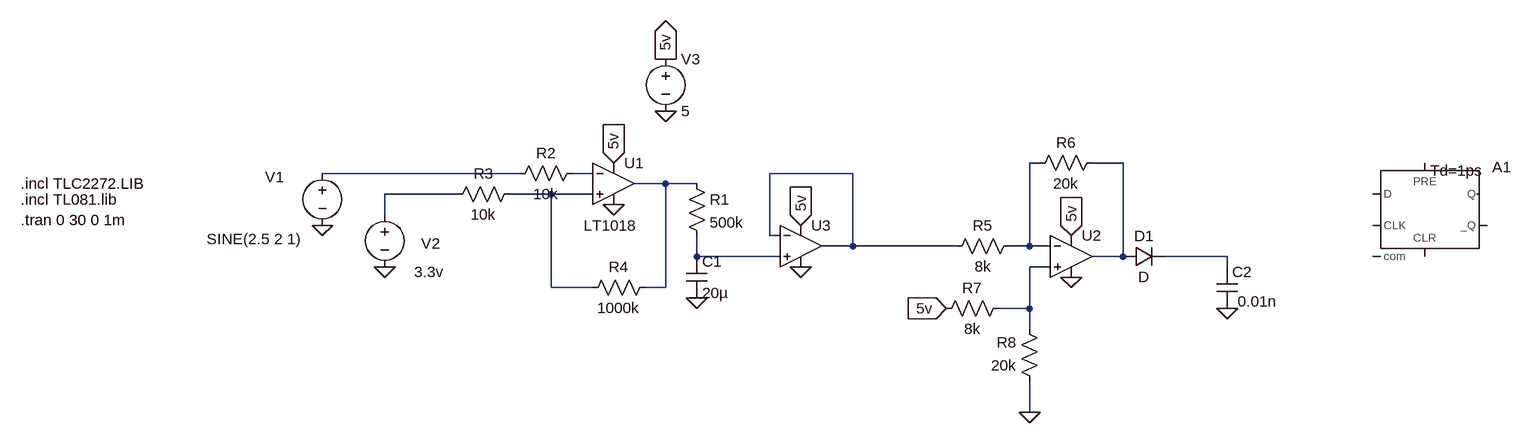
[diagram p0: schematic analogue.asc]
analogue.asc, the LTspice schematic file:
Version 4
SHEET 1 2016 680
WIRE 1184 -48 1168 -48
WIRE 1312 -48 1264 -48
WIRE 384 -32 80 -32
WIRE 496 -32 464 -32
WIRE 896 -32 768 -32
WIRE 608 -16 560 -16
WIRE 656 -16 608 -16
WIRE 288 0 176 0
WIRE 432 0 368 0
WIRE 496 0 432 0
WIRE 176 32 176 0
WIRE 768 64 768 -32
WIRE 784 64 768 64
WIRE 896 80 896 -32
WIRE 896 80 848 80
WIRE 1056 80 896 80
WIRE 1168 80 1168 -48
WIRE 1168 80 1136 80
WIRE 1200 80 1168 80
WIRE 656 96 656 64
WIRE 784 96 656 96
WIRE 1312 96 1312 -48
WIRE 1312 96 1264 96
WIRE 1472 96 1376 96
WIRE 656 112 656 96
WIRE 1200 112 1168 112
WIRE 1472 112 1472 96
WIRE 432 144 432 0
WIRE 496 144 432 144
WIRE 608 144 608 -16
WIRE 608 144 576 144
WIRE 1168 176 1168 112
WIRE 1168 176 1120 176
WIRE 1168 208 1168 176
WIRE 1168 336 1168 288
FLAG 80 48 0
FLAG 1472 176 0
FLAG 656 160 0
FLAG 528 16 0
FLAG 528 -48 5v
IOPIN 528 -48 In
FLAG 176 112 0
FLAG 608 -128 0
FLAG 608 -208 5v
IOPIN 608 -208 Out
FLAG 1232 128 0
FLAG 1232 64 5v
IOPIN 1232 64 In
FLAG 816 112 0
FLAG 816 48 5v
IOPIN 816 48 In
FLAG 1040 176 5v
IOPIN 1040 176 In
FLAG 1168 336 0
SYMBOL Digital\\dflop 1776 -48 R0
WINDOW 3 8 12 Left 2
SYMATTR Value Td=1ps
SYMATTR InstName A1
SYMATTR SpiceLine Vhigh 5 Trise 10n
SYMBOL voltage 80 -48 R0
WINDOW 123 0 0 Left 0
WINDOW 39 0 0 Left 0
WINDOW 0 -88 22 Left 2
WINDOW 3 -178 117 Left 2
SYMATTR InstName V1
SYMATTR Value SINE(2.5 2 1)
SYMBOL res 640 -32 R0
SYMATTR InstName R1
SYMATTR Value 500k
SYMBOL cap 640 96 R0
SYMATTR InstName C1
SYMATTR Value 20µ
SYMBOL diode 1312 112 R270
WINDOW 0 32 32 VTop 2
WINDOW 3 0 32 VBottom 2
SYMATTR InstName D1
SYMBOL cap 1456 112 R0
WINDOW 3 32 53 Left 2
SYMATTR InstName C2
SYMATTR Value 0.01n
SYMBOL res 480 -48 R90
WINDOW 0 0 56 VBottom 2
WINDOW 3 32 56 VTop 2
SYMATTR InstName R2
SYMATTR Value 10k
SYMBOL res 384 -16 R90
WINDOW 0 0 56 VBottom 2
WINDOW 3 32 56 VTop 2
SYMATTR InstName R3
SYMATTR Value 10k
SYMBOL res 592 128 R90
WINDOW 0 0 56 VBottom 2
WINDOW 3 32 56 VTop 2
SYMATTR InstName R4
SYMATTR Value 1000k
SYMBOL Comparators\\LT1018 528 -16 R0
WINDOW 3 -46 64 Left 2
SYMATTR InstName U1
SYMBOL voltage 176 16 R0
WINDOW 0 56 60 Left 2
WINDOW 3 45 104 Left 2
WINDOW 123 0 0 Left 0
WINDOW 39 0 0 Left 0
SYMATTR InstName V2
SYMATTR Value 3.3v
SYMBOL voltage 608 -224 R0
WINDOW 123 0 0 Left 0
WINDOW 39 0 0 Left 0
SYMATTR InstName V3
SYMATTR Value 5
SYMBOL Opamps\\UniversalOpamp2 1232 96 R0
SYMATTR InstName U2
SYMBOL res 1152 64 R90
WINDOW 0 0 56 VBottom 2
WINDOW 3 32 56 VTop 2
SYMATTR InstName R5
SYMATTR Value 8k
SYMBOL res 1280 -64 R90
WINDOW 0 0 56 VBottom 2
WINDOW 3 32 56 VTop 2
SYMATTR InstName R6
SYMATTR Value 20k
SYMBOL Opamps\\UniversalOpamp2 816 80 R0
SYMATTR InstName U3
SYMBOL res 1136 160 R90
WINDOW 0 0 56 VBottom 2
WINDOW 3 32 56 VTop 2
SYMATTR InstName R7
SYMATTR Value 8k
SYMBOL res 1184 304 R180
WINDOW 0 36 76 Left 2
WINDOW 3 36 40 Left 2
SYMATTR InstName R8
SYMATTR Value 20k
TEXT -384 40 Left 2 !.tran 0 30 0 1m
TEXT -384 -16 Left 2 !.incl TLC2272.LIB
TEXT -384 8 Left 2 !.incl TL081.lib

The netlist it stands for:
* analogue.asc
A1 0 0 0 0 0 0 0 0 DFLOP Td=1ps Vhigh 5 Trise 10n
V1 N003 0 SINE(2.5 2 1)
R1 N006 N009 500k
C1 N009 0 20µ
D1 N002 N010 D
C2 N010 0 0.01n
R2 N004 N003 10k
R3 N008 N007 10k
R4 N006 N008 1000k
XU1 N008 N004 5v 0 N006 LT1018  ; pins In+ In- V+ V- OUT
V2 N007 0 3.3v
V3 5v 0 5
XU2 N011 N001 5v 0 N002 level.2 Avol=1Meg GBW=10Meg Slew=10Meg ilimit=25m rail=0 Vos=0 phimargin=45 en=0 enk=0 in=0 ink=0 Rin=500Meg  ; pins IN+ IN- V+ V- OUT
R5 N001 N005 8k
R6 N002 N001 20k
XU3 N009 N005 5v 0 N005 level.2 Avol=1Meg GBW=10Meg Slew=10Meg ilimit=25m rail=0 Vos=0 phimargin=45 en=0 enk=0 in=0 ink=0 Rin=500Meg  ; pins IN+ IN- V+ V- OUT
R7 N011 5v 8k
R8 0 N011 20k
.model D D
.lib standard.dio
.tran 0 30 0 1m
.incl TLC2272.LIB
.incl TL081.lib
.lib LTC1.lib
.lib UniversalOpamps2.sub
.backanno
.end